# Altium schematic sheet Rear Loom.SchDoc
size A4; SheetNumber: 2; SheetTotal: 3
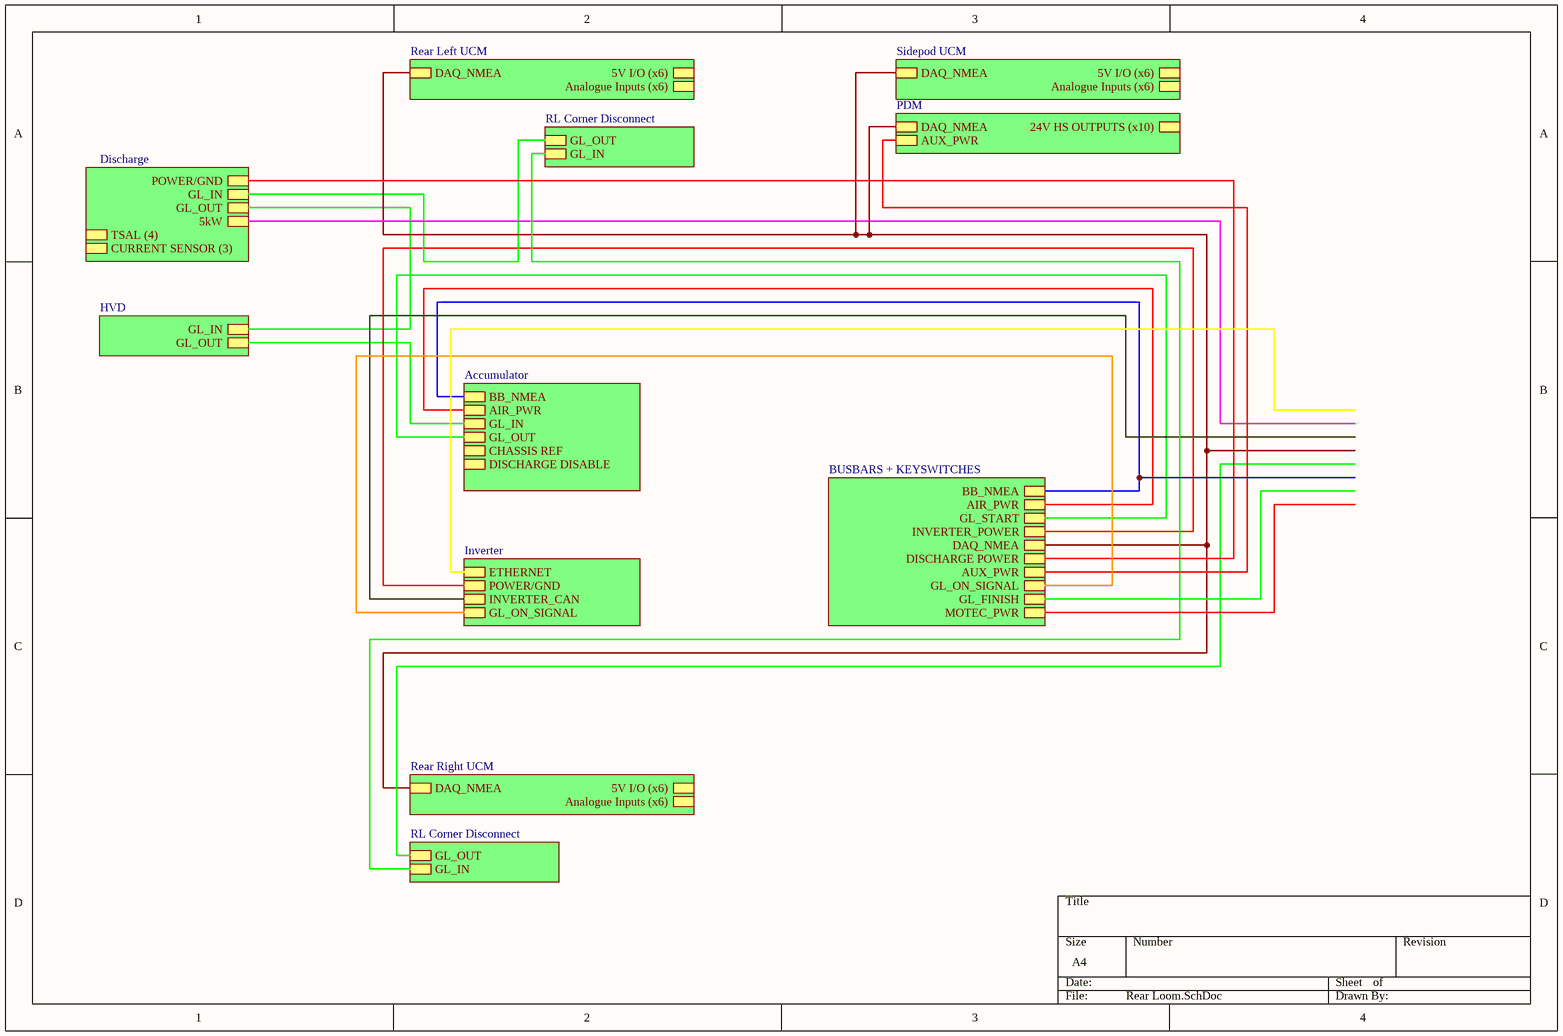
[diagram p0: Rear Loom.SchDoc]

## Sub-sheets
Accumulator = File Name: BB_NMEA, AIR_PWR, GL_IN, GL_OUT, CHASSIS REF, DISCHARGE DISABLE
BUSBARS + KEYSWITCHES = File Name: BB_NMEA, AIR_PWR, GL_START, INVERTER_POWER, DAQ_NMEA, DISCHARGE POWER, AUX_PWR, GL_ON_SIGNAL, GL_FINISH, MOTEC_PWR
Discharge = File Name: POWER/GND, GL_OUT, GL_IN, TSAL (4), CURRENT SENSOR (3), 5kW
HVD = File Name: GL_IN, GL_OUT
Inverter = File Name: POWER/GND, INVERTER_CAN, GL_ON_SIGNAL, ETHERNET
PDM = File Name: DAQ_NMEA, 24V HS OUTPUTS (x10), AUX_PWR
Rear Left UCM = File Name: DAQ_NMEA, 5V I/O (x6), Analogue Inputs (x6)
Rear Right UCM = File Name: DAQ_NMEA, 5V I/O (x6), Analogue Inputs (x6)
RL Corner Disconnect = File Name: GL_OUT, GL_IN
RL Corner Disconnect = File Name: GL_OUT, GL_IN
Sidepod UCM = File Name: DAQ_NMEA, 5V I/O (x6), Analogue Inputs (x6)

## Nets
(unnamed): sheet Discharge/POWER/GND, sheet BUSBARS + KEYSWITCHES/DISCHARGE POWER
(unnamed): sheet Discharge/GL_OUT, sheet HVD/GL_IN
(unnamed): sheet Discharge/GL_IN, sheet RL Corner Disconnect/GL_OUT
(unnamed): sheet Accumulator/BB_NMEA, sheet BUSBARS + KEYSWITCHES/BB_NMEA
(unnamed): sheet Accumulator/AIR_PWR, sheet BUSBARS + KEYSWITCHES/AIR_PWR
(unnamed): sheet Accumulator/GL_IN, sheet HVD/GL_OUT
(unnamed): sheet Accumulator/GL_OUT, sheet BUSBARS + KEYSWITCHES/GL_START
(unnamed): sheet Sidepod UCM/DAQ_NMEA, sheet BUSBARS + KEYSWITCHES/DAQ_NMEA, sheet Rear Left UCM/DAQ_NMEA, sheet Rear Right UCM/DAQ_NMEA, sheet PDM/DAQ_NMEA
(unnamed): sheet Inverter/POWER/GND, sheet BUSBARS + KEYSWITCHES/INVERTER_POWER
(unnamed): sheet Inverter/GL_ON_SIGNAL, sheet BUSBARS + KEYSWITCHES/GL_ON_SIGNAL
(unnamed): sheet BUSBARS + KEYSWITCHES/AUX_PWR, sheet PDM/AUX_PWR
(unnamed): sheet RL Corner Disconnect/GL_IN, sheet RL Corner Disconnect/GL_IN